# EAGLE design Adafruit Flora LSM9DS0 9DoF (EAGLE 6.3)
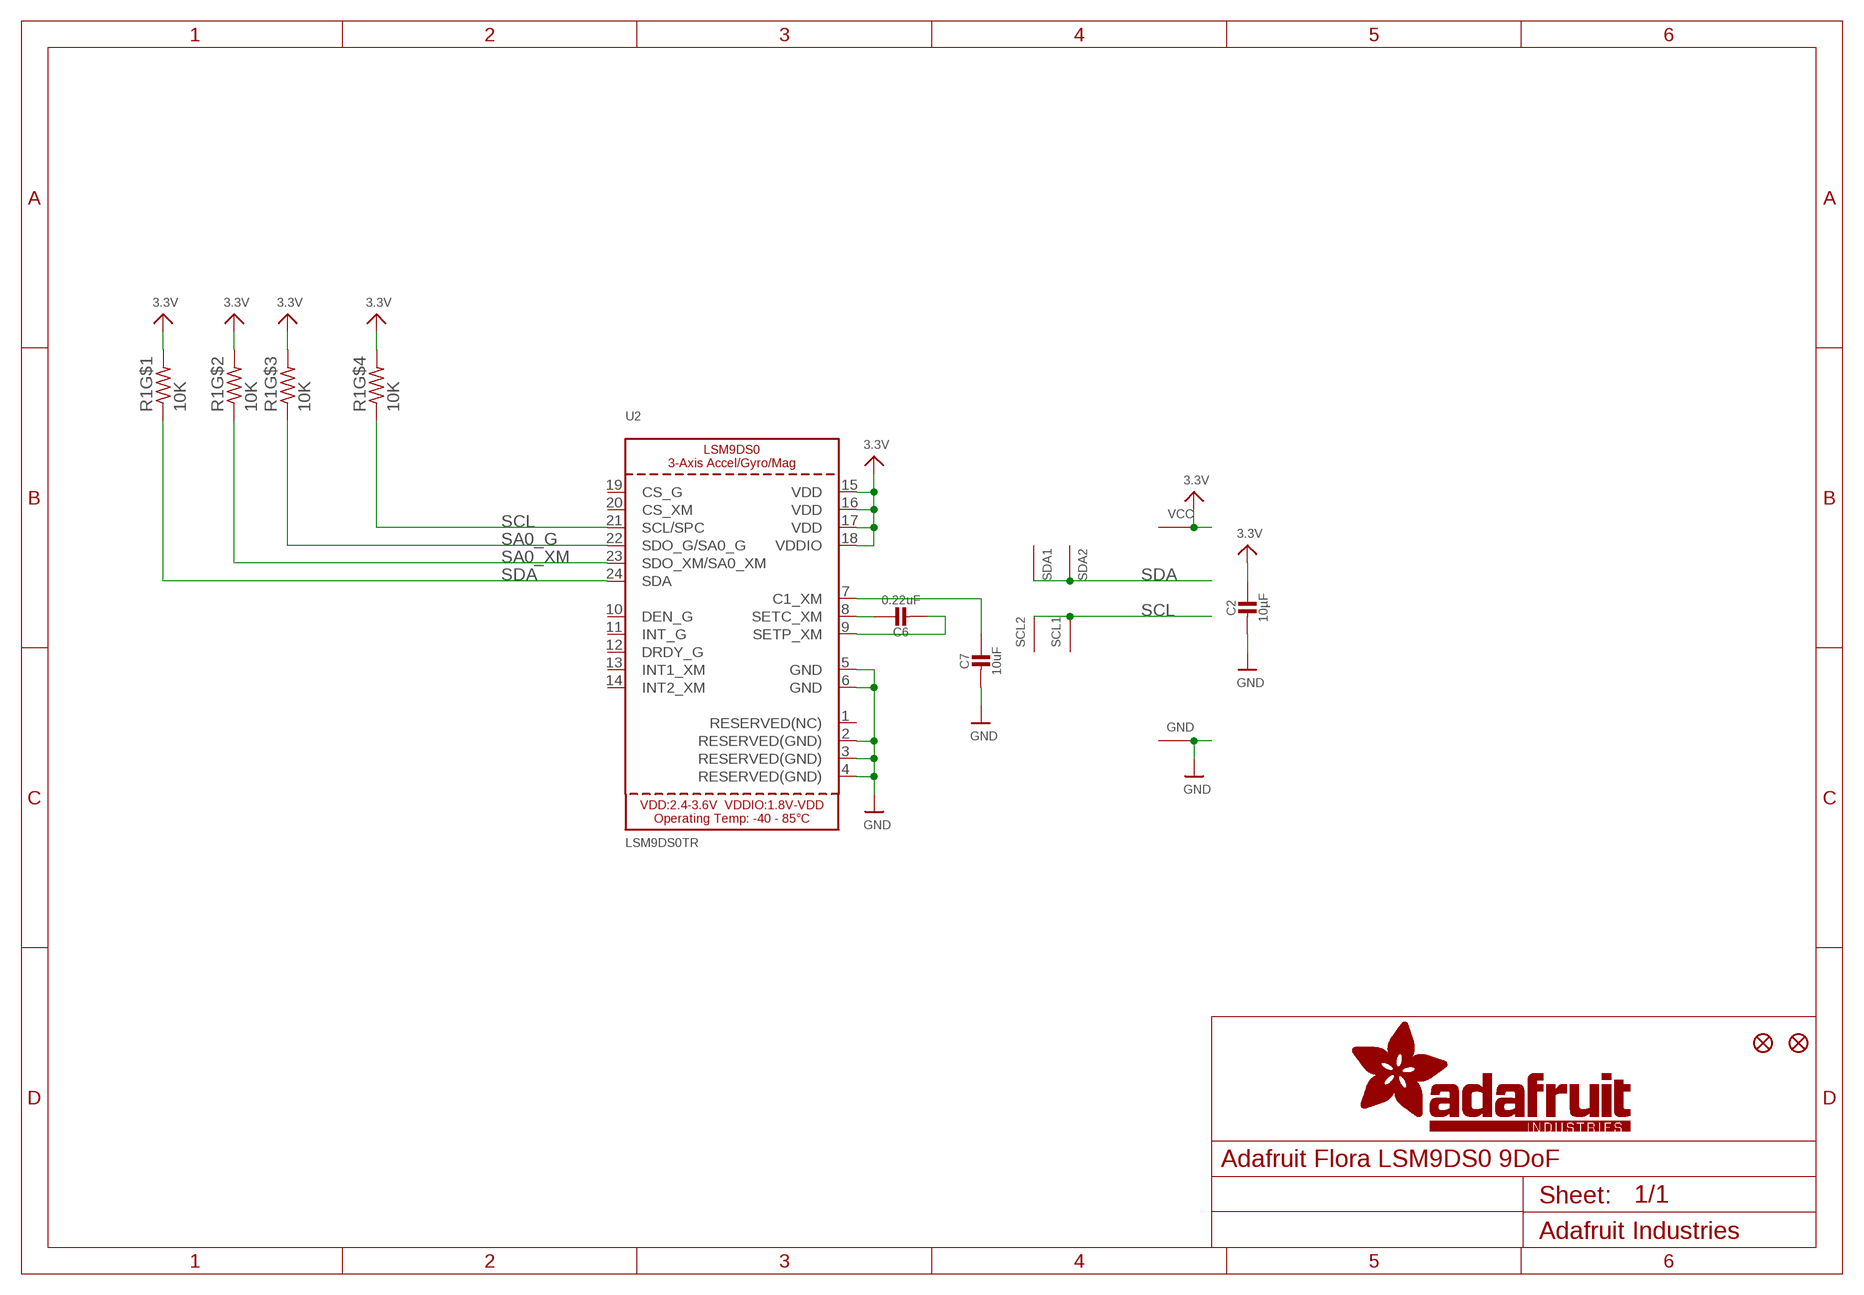
[diagram p0: schematic, sheet 1]

## Parts
C2  10µF  CAP_CERAMIC0805_10MGAP  [0805_10MGAP]
C6  0.22uF  CAP_CERAMIC0805-NOOUTLINE  [0805-NO]
C7  10uF  CAP_CERAMIC0805-NOOUTLINE  [0805-NO]
FID1  FIDUCIAL""  [FIDUCIAL_1MM]
FID2  FIDUCIAL""  [FIDUCIAL_1MM]
GND  SEWTAP0.5IN  [SEWINGTAP_0.5]
R1  10K  RESISTOR_4PACK_US  [RESPACK_4X0603]
SCL1  SEWTAP0.5IN  [SEWINGTAP_0.5]
SCL2  SEWTAP0.5IN  [SEWINGTAP_0.5]
SDA1  SEWTAP0.5IN  [SEWINGTAP_0.5]
SDA2  SEWTAP0.5IN  [SEWINGTAP_0.5]
U2  LSM9DS0TR  LSM9DS0  [LGA24_4X4MM]
VCC  SEWTAP0.5IN  [SEWINGTAP_0.5]

## Nets
3.3V: C2.1 R1.5 R1.6 R1.7 R1.8 U2.15(VDD) U2.16(VDD) U2.17(VDD) U2.18(VDDIO) VCC.TAP(SEW)
GND: C2.2 C7.2 GND.TAP(SEW) U2.2(RESERVED(GND)) U2.3(RESERVED(GND)) U2.4(RESERVED(GND)) U2.5(GND) U2.6(GND)
N$1: C6.1 U2.8(SETC_XM)
N$2: C6.2 U2.9(SETP_XM)
N$6: C7.1 U2.7(C1_XM)
SA0_G: R1.3 U2.22(SDO_G/SA0_G)
SA0_XM: R1.2 U2.23(SDO_XM/SA0_XM)
SCL: R1.4 SCL1.TAP(SEW) SCL2.TAP(SEW) U2.21(SCL/SPC)
SDA: R1.1 SDA1.TAP(SEW) SDA2.TAP(SEW) U2.24(SDA)
Unconnected: U2.1(RESERVED(NC)) U2.10(DEN_G) U2.11(INT_G) U2.12(DRDY_G) U2.13(INT1_XM) U2.14(INT2_XM) U2.19(CS_G) U2.20(CS_XM)

## Library data of the parts
C2 C6 C7 = microbuilder:CAP_CERAMIC: Ceramic Capacitors For new designs, use the packages preceded by an '_' character since they are more reliable: The following footprints should be used on most boards: _0402 - Standard footprint for regular board layouts _0603 - Standard footprint for regular board layouts _0805 - Standard footprint for regular board layouts _1206 - Standard footprint for regular board layouts For extremely tight-pitch boards where space is at a premium, the following 'micro-pitch' footprints can be used (smaller pads, no silkscreen outline, etc.): _0402MP - Micro-pitch footprint for very dense/compact boards _0603MP - Micro-pitch footprint for very dense/compact boards _0805MP - Micro-pitch footprint for very dense/compact boards _1206MP - Micro-pitch footprint for very dense/compact boards
FID1 FID2 = microbuilder:FIDUCIAL: Fiducial Alignment Points Various fiducial points for machine vision alignment.
GND SCL1 SCL2 SDA1 SDA2 VCC = adafruit:SEWTAP
R1 = microbuilder:RESISTOR_4PACK_US: Resistor Packs (4 resistors) 4 x 0603 10K 1/16W - Digikey: YC164J-10KCT-ND
U2 = microbuilder:LSM9DS0: LSM9DS0 3-Axis Accelerometer/Gyroscope/Magnetometer ±2/±4/±6/±8/±16 g linear acceleration ±2/±4/±8/±12 gauss magnetic ±245/±500/±2000 dps angular rate I2C/SPI Interface 2.4-3.6V Supply, 1.8V - VDD Logic

## Board
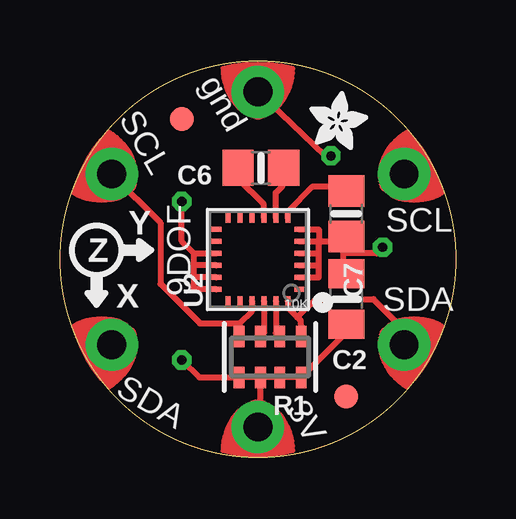
[diagram p1: board, top side]
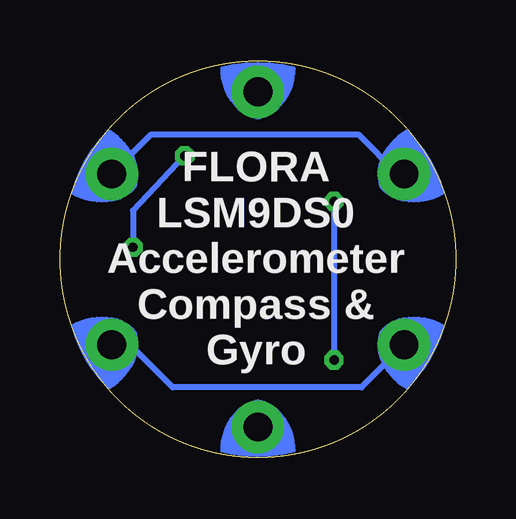
[diagram p2: board, bottom side, seen from below]

Size 16.51 x 16.51 mm. Coordinates in mm from the lower left corner, seen from the top.
Outline: circle at 8.26,8.26 radius 8.26
Copper layers (1*16): Top 0.035mm / dielectric 1.5mm / Bottom 0.035mm
Design rules "adafruit": minimum track width 8mil, minimum drill 15.5mil, track to track 8mil, track to pad 8mil, pad to pad 8mil, via to via 8mil, smd to smd 8mil, copper to edge 10mil, drill to drill 8mil, minimum pad ring 10mil, minimum via ring 8mil, stop-mask expansion 2mil, vias tented up to drill 20mil, thermal gap 10mil

### Footprints (pad centres in the part's own frame; a part is rotated, then mirrored left to right if it is on the bottom)
0805_10MGAP = smd 1.2 x 1.5: 1 -1.05,0; 2 1.05,0
0805-NO = smd 1.3 x 1.5: 1 -0.95,0; 2 0.95,0
FIDUCIAL_1MM = smd 1 x 1: 1 0,0
SEWINGTAP_0.5 = drill 1.2 pad 2.184: TAP 0,0
RESPACK_4X0603 = smd 0.45 x 0.9: 1 -1.3,-0.85; 2 -0.4,-0.85; 3 0.4,-0.85; 4 1.3,-0.85; 5 1.3,0.85; 6 0.4,0.85; 7 -0.4,0.85; 8 -1.3,0.85
LGA24_4X4MM = smd 0.21 x 0.4: 1 -1.25,-1.725; 2 -0.75,-1.725; 3 -0.25,-1.725; 4 0.25,-1.725; 5 0.75,-1.725; 6 1.25,-1.725; 13 1.25,1.725; 14 0.75,1.725; 15 0.25,1.725; 16 -0.25,1.725; 17 -0.75,1.725; 18 -1.25,1.725 | smd 0.4 x 0.21: 7 1.725,-1.25; 8 1.725,-0.75; 9 1.725,-0.25; 10 1.725,0.25; 11 1.725,0.75; 12 1.725,1.25; 19 -1.725,1.25; 20 -1.725,0.75; 21 -1.725,0.25; 22 -1.725,-0.25; 23 -1.725,-0.75; 24 -1.725,-1.25

### Placement (x,y rotation side)
C2  11.94,6.6 90 top
C6  8.38,12.07 180 top
C7  11.94,10.16 270 top
FID1  5.08,14.1 0 top
FID2  11.94,2.54 0 top
GND  8.26,15.24 0 top
R1  8.76,4.19 180 top
SCL1  14.35,11.81 300 top
SCL2  2.16,11.81 60 top
SDA1  14.35,4.7 240 top
SDA2  2.16,4.7 120 top
U2  8.26,8.26 90 top
U$4  [ADAFRUIT_2.5MM]  10.41,12.83 0 top
VCC  8.26,1.27 180 top

### Tracks (layer width: path | path; a pad name or v marks a point on that pad's centre or on a via)
3.3V  (via drill 0.39)
  Top 0.254: U2.18 5.59,7.01 5.59,7.51 | 5.59,7.51 5.59,8.01 | 5.59,8.01 5.59,8.51 | 5.59,8.51 U2.15 | U2.16 5.59,8.01 | U2.17 5.59,7.51 | R1.6 R1.7 R1.8 12.19,5.47 C2.1 | R1.6 R1.5 5.8,3.34 v5.08,4.06 | VCC.TAP 8.36,1.14 R1.6 | 5.59,8.51 5.08,9.02 v5.08,10.67
  Bottom 0.254: v5.08,10.67 v5.08,4.06
GND  (via drill 0.39)
  Top 0.254: U2.5 10.8,9.01 | 10.8,9.01 11.61,9.01 C7.2 | C7.2 11.81,8.51 | 11.81,8.51 11.81,7.94 C2.2 | U2.4 10.8,8.51 | 10.8,8.51 10.8,9.01 | U2.3 10.8,8.01 | 10.8,8.01 10.8,8.51 | U2.2 10.8,7.51 10.8,8.01 | U2.6 10.8,9.51 10.8,9.01 | 11.88,9.14 C7.2 | GND.TAP 11.05,12.57 v11.3,12.57 | v13.46,8.76 13.21,8.51 11.81,8.51
  Bottom 0.254: v11.3,12.57 13.46,10.29 v13.46,8.76
N$1
  Top 0.254: U2.8 9.01,11.04 9.27,11.3 9.27,12 C6.1
N$2
  Top 0.254: U2.9 8.51,10.55 7.43,11.62 C6.2
N$6
  Top 0.254: U2.7 9.51,10.27 10.54,11.3 11.62,11.3 C7.1
SA0_G
  Top 0.254: U2.22 8.51,5.18 R1.3
SA0_XM
  Top 0.254: U2.23 9.01,5.2 R1.2
SCL
  Top 0.254: U2.21 8.01,6.1 7.49,5.59 | 7.49,5.59 7.49,5.07 R1.4 | SCL2.TAP 4.19,9.78 4.19,7.24 5.84,5.59 7.49,5.59
  Bottom 0.254: SCL1.TAP 12.7,13.46 4.06,13.46 2.41,11.81 SCL2.TAP
SDA
  Top 0.254: U2.24 9.51,6.24 9.91,5.84 | 9.91,5.84 10.03,5.72 R1.1 | 13.84,4.19 SDA1.TAP 14.35,5.33 13.08,6.6 10.67,6.6 9.91,5.84
  Bottom 0.254: SDA2.TAP 3.94,2.92 11.81,2.92 13.59,4.7 SDA1.TAP

### Text on the board
tPlace: gnd | SCL | Y | Z | SCL | X | 9DOF | SDA | SDA | 3V
bPlace: FLORA / LSM9DS0 / Accelerometer / Compass & / Gyro